# Altium project universky.PrjPcb
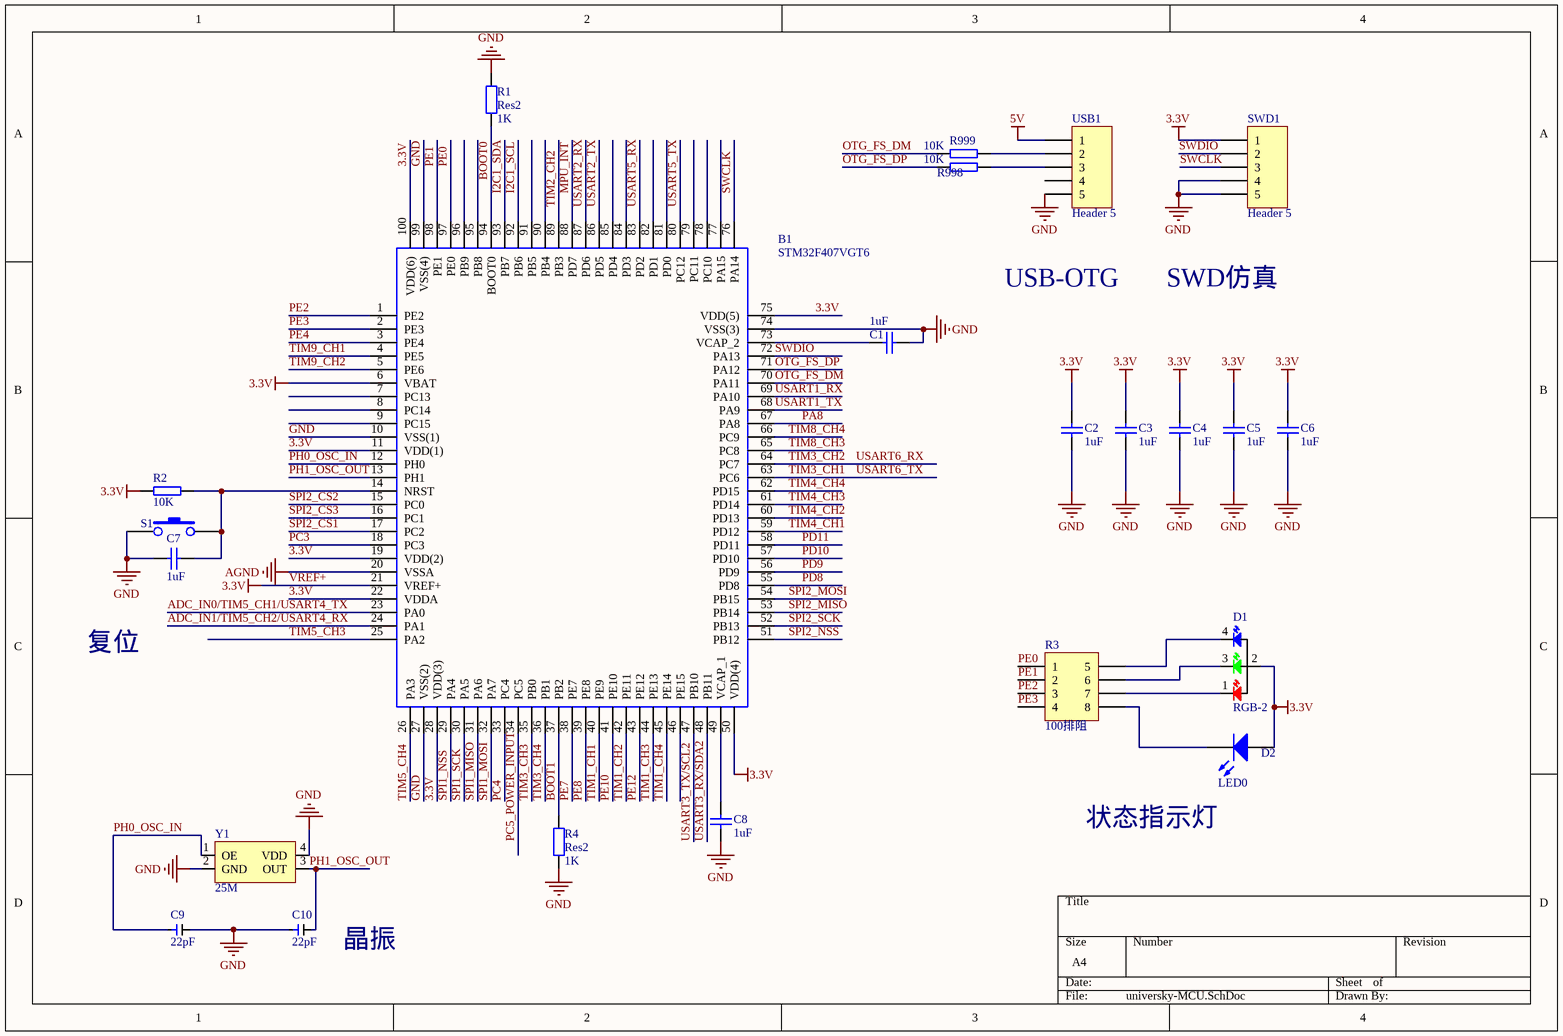
[diagram p0: universky-MCU.SchDoc]
4 sheets, 69 parts. Net scope: global (net labels, ports and power ports of the same name join across sheets).
Board file: universkyNew.PcbDoc
Sheets:
  universky-MCU.SchDoc
  universky-POWER.SchDoc
  universky-CONNECTOR.SchDoc
  universky-SENSOR.SchDoc

## Sheet universky-MCU.SchDoc
size A4

### Parts
B1  STM32F407VGT6  [QFP50P1600X1600X160-100N]
C1  value 1uF  [0603_C]  (hidden comment: Cap)
C2  value 1uF  [0603_C]  (hidden comment: Cap)
C3  value 1uF  [0603_C]  (hidden comment: Cap)
C4  value 1uF  [0603_C]  (hidden comment: Cap)
C5  value 1uF  [0603_C]  (hidden comment: Cap)
C6  value 1uF  [0603_C]  (hidden comment: Cap)
C7  value 1uF  [0603_C]  (hidden comment: Cap)
C8  value 1uF  [0603_C]  (hidden comment: Cap)
C9  22pF  [0603_C]
C10  22pF  [0603_C]
D1  RGB-2  [RGB-2]
D2  LED0  [0603_LED]
R1  Res2  value 1K  [0603_R]
R2  RES_10K  [0603_R]  (value not drawn)
R3  100排阻  [HDR_R_4]
R4  Res2  value 1K  [0603_R]
R998  RES_10K  [0603_R]  (value not drawn)
R999  RES_10K  [0603_R]  (value not drawn)
S1  SW-PB  [KEY_SMD]  (value not drawn)
SWD1  Header 5  [USB_M]
USB1  Header 5  [USB_M]
Y1  value 25M  [XTAL_3225]  (hidden comment: XATLS)

### Nets
3.3V: B1.6(VBAT) B1.11(VDD(1)) B1.19(VDD(2)) B1.21(VREF+) B1.22(VDDA) B1.28(VDD(3)) B1.50(VDD(4)) B1.75(VDD(5)) B1.100(VDD(6)) C2.2 C3.2 C4.2 C5.2 C6.2 D1.2 D2.1(A) R2.2 SWD1.1  [also labelled VREF+]
5V: USB1.1
AGND: B1.20(VSSA)
GND: B1.10(VSS(1)) B1.27(VSS(2)) B1.74(VSS(3)) B1.99(VSS(4)) C1.2 C2.1 C3.1 C4.1 C5.1 C6.1 C7.2 C8.1 C9.2 C10.1 R1.2 R4.1 S1.1 SWD1.4 SWD1.5 USB1.5 Y1.2(GND) Y1.4(VDD)
ADC_IN0/TIM5_CH1/USART4_TX: B1.23(PA0)
ADC_IN1/TIM5_CH2/USART4_RX: B1.24(PA1)
BOOT0: B1.94(BOOT0) R1.1
BOOT1: B1.37(PB2) R4.2
I2C1_SCL: B1.92(PB6)
I2C1_SDA: B1.93(PB7)
MPU_INT: B1.88(PD7)
OTG_FS_DM: B1.70(PA11) R999.2
OTG_FS_DP: B1.71(PA12) R998.2
PA8: B1.67(PA8)
PC3: B1.18(PC3)
PC4: B1.33(PC4)
PC5_POWER_INPUT: B1.34(PC5)
PD8: B1.55(PD8)
PD9: B1.56(PD9)
PD10: B1.57(PD10)
PD11: B1.58(PD11)
PE0: B1.97(PE0) R3.1
PE1: B1.98(PE1) R3.2
PE2: B1.1(PE2) R3.3
PE3: B1.2(PE3) R3.4
PE4: B1.3(PE4)
PE7: B1.38(PE7)
PE8: B1.39(PE8)
PE10: B1.41(PE10)
PE12: B1.43(PE12)
PH0_OSC_IN: B1.12(PH0) C9.1 Y1.1(OE)
PH1_OSC_OUT: B1.13(PH1) C10.2 Y1.3(OUT)
SPI1_MISO: B1.31(PA6)
SPI1_MOSI: B1.32(PA7)
SPI1_NSS: B1.29(PA4)
SPI1_SCK: B1.30(PA5)
SPI2_CS1: B1.17(PC2)
SPI2_CS2: B1.15(PC0)
SPI2_CS3: B1.16(PC1)
SPI2_MISO: B1.53(PB14)
SPI2_MOSI: B1.54(PB15)
SPI2_NSS: B1.51(PB12)
SPI2_SCK: B1.52(PB13)
SWCLK: B1.76(PA14) SWD1.3
SWDIO: B1.72(PA13) SWD1.2
TIM1_CH1: B1.40(PE9)
TIM1_CH2: B1.42(PE11)
TIM1_CH3: B1.44(PE13)
TIM1_CH4: B1.45(PE14)
TIM2_CH2: B1.89(PB3)
TIM3_CH1: B1.63(PC6)  [also labelled USART6_TX]
TIM3_CH2: B1.64(PC7)  [also labelled USART6_RX]
TIM3_CH3: B1.35(PB0)
TIM3_CH4: B1.36(PB1)
TIM4_CH1: B1.59(PD12)
TIM4_CH2: B1.60(PD13)
TIM4_CH3: B1.61(PD14)
TIM4_CH4: B1.62(PD15)
TIM5_CH3: B1.25(PA2)
TIM5_CH4: B1.26(PA3)
TIM8_CH3: B1.65(PC8)
TIM8_CH4: B1.66(PC9)
TIM9_CH1: B1.4(PE5)
TIM9_CH2: B1.5(PE6)
USART1_RX: B1.69(PA10)
USART1_TX: B1.68(PA9)
USART2_RX: B1.87(PD6)
USART2_TX: B1.86(PD5)
USART3_RX/SDA2: B1.48(PB11)
USART3_TX/SCL2: B1.47(PB10)
USART5_RX: B1.83(PD2)
USART5_TX: B1.80(PC12)
NetB1_14: B1.14(NRST) C7.1 R2.1 S1.2
NetB1_49: B1.49(VCAP_1) C8.2
NetB1_73: B1.73(VCAP_2) C1.1
NetD1_1: D1.1(R) R3.7
NetD1_3: D1.3(G) R3.6
NetD1_4: D1.4(B) R3.5
NetD2_2: D2.2(K) R3.8
NetR998_1: R998.1 USB1.3
NetR999_1: R999.1 USB1.2

Not connected (* = marked no-connect by the designer): B1 7(PC13) 8(PC14) 9(PC15) 46(PE15) 77(PA15) 78(PC10) 79(PC11) 81(PD0) 82(PD1) 84(PD3) 85(PD4) 90(PB4) 91(PB5) 95(PB8) 96(PB9); USB1 4

### Notes on the sheet
- USB-OTG
- SWD仿真
- 复位
- 状态指示灯
- (near C10) 晶振
- (in symbol RES_10K) 10K

### Library data of the parts
B1 = STM32F407VGT6: MCU 32-Bit, ARM Cortex M4, 1MB Flash STMicroelectronics STM32F407VGT6, 32bit ARM Cortex M4F Microcontroller, 168MHz, 1024 kB Flash, 100-Pin LQFP; Allied_Number: 70391107; Geometry.Height: 1.6mm; Supplier_Name: RS; RS Part Number: 7468226; Manufacturer_Name: STMicroelectronics; Manufacturer_Part_Number: STM32F407VGT6; Other Part Number: *; Datasheet Link: http://www.st.com/web/en/resource/technical/document/datasheet/DM00037051.pdf; 3D Package: *
C1-C8 = Cap: Capacitor; Published: 8-Jun-2000; LatestRevisionDate: 17-Jul-2002; LatestRevisionNote: Re-released for DXP Platform.; PackageReference: RAD-0.3; Publisher: Altium Limited; PackageDescription: Radial Cap, Thru-Hole; 2 Leads; 0.3 in Pin Spacing
C9 C10 = CAP
D2 = LED0: Typical INFRARED GaAs LED; Published: 8-Jun-2000; LatestRevisionDate: 08-Jul-2005; LatestRevisionNote: Mech Layer 1 removed.; PackageReference: LED-0; Publisher: Altium Limited; PackageDescription: LED; 2 Leads
R1 R4 = Res2: Resistor; Published: 8-Jun-2000; LatestRevisionDate: 17-Jul-2002; LatestRevisionNote: Re-released for DXP Platform.; PackageReference: AXIAL-0.4; Publisher: Altium Limited; PackageDescription: Axial Device, Thru-Hole; 2 Leads; 0.4 in Pin Spacing
R3 = Header 4X2A: Header, 4-Pin, Dual row; LatestRevisionDate: 17-Jul-2002; LatestRevisionNote: Re-released for DXP Platform.; Publisher: Altium Limited
SWD1 USB1 = Header 5: Header, 5-Pin; LatestRevisionDate: 17-Jul-2002; LatestRevisionNote: Re-released for DXP Platform.; Publisher: Altium Limited
Y1 = XATLS: 贴片有源晶振

## Sheet universky-POWER.SchDoc
size A4
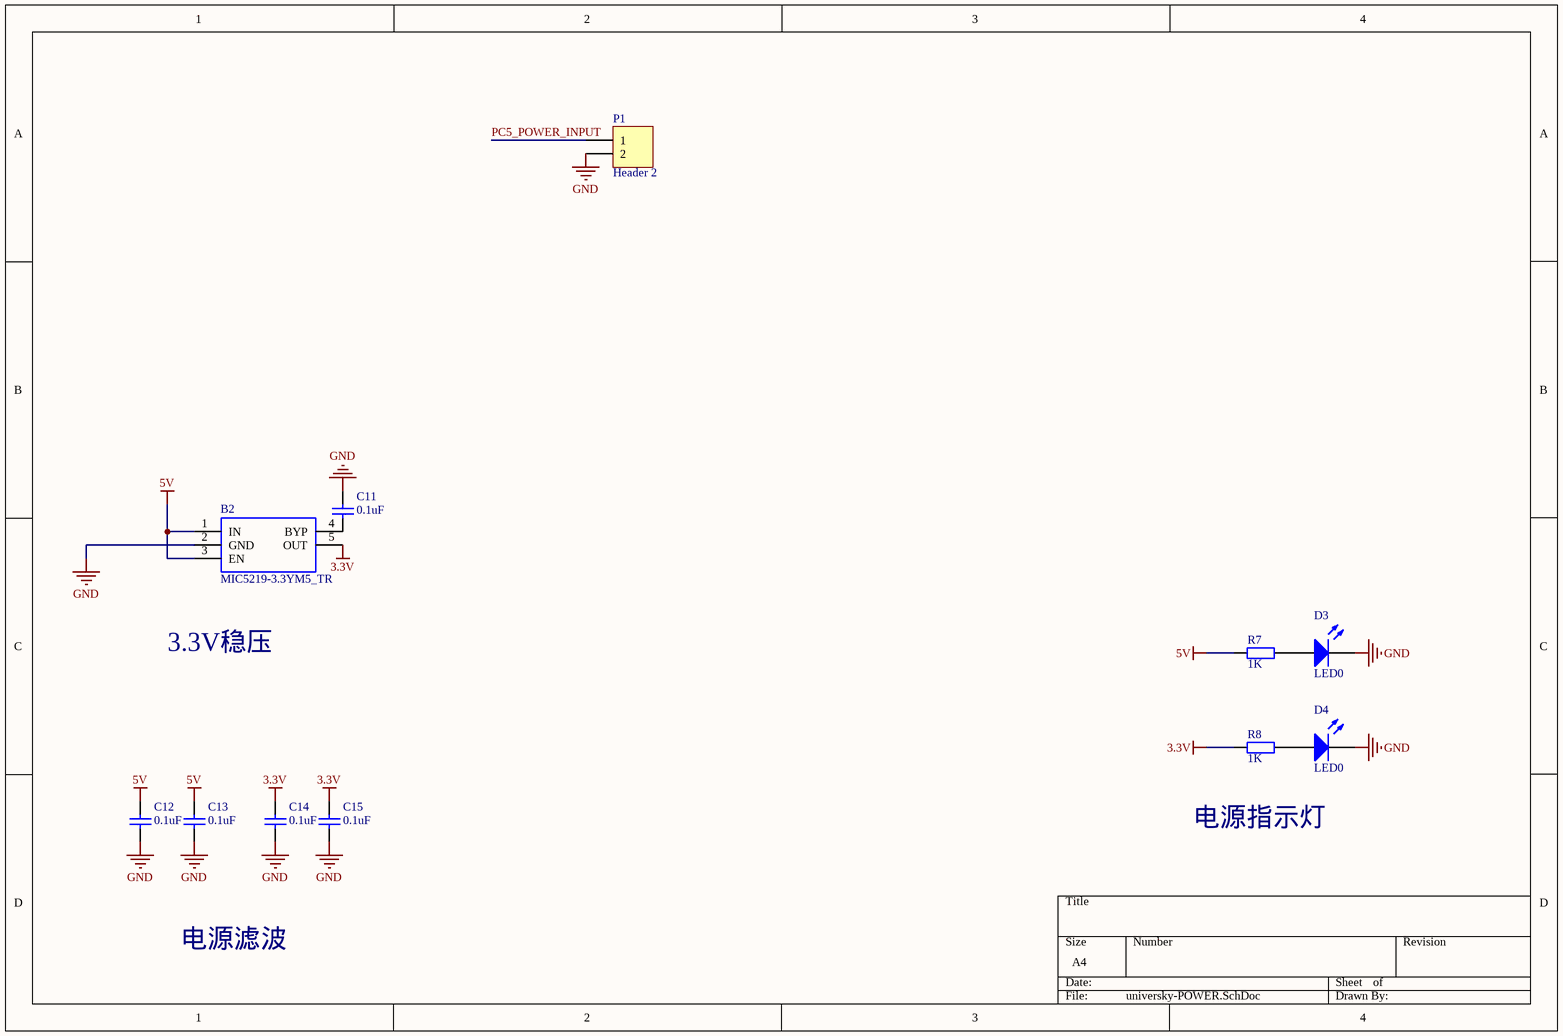
[diagram p1: universky-POWER.SchDoc]

### Parts
B2  MIC5219-3.3YM5_TR  [SOT95P280X145-5N]
C11  value 0.1uF  [0603_C]  (hidden comment: Cap)
C12  value 0.1uF  [0603_C]  (hidden comment: Cap)
C13  value 0.1uF  [0603_C]  (hidden comment: Cap)
C14  value 0.1uF  [0603_C]  (hidden comment: Cap)
C15  value 0.1uF  [0603_C]  (hidden comment: Cap)
D3  LED0  [0603_LED]
D4  LED0  [0603_LED]
P1  Header 2  [HDR1X2]
R7  value 1K  [0603_R]  (hidden comment: Res2)
R8  value 1K  [0603_R]  (hidden comment: Res2)

### Nets
3.3V: B2.5(OUT) C14.2 C15.2 R8.1
5V: B2.1(IN) B2.3(EN) C12.2 C13.2 R7.1
GND: B2.2(GND) C11.2 C12.1 C13.1 C14.1 C15.1 D3.2(K) D4.2(K) P1.2
PC5_POWER_INPUT: P1.1
NetB2_4: B2.4(BYP) C11.1
NetD3_1: D3.1(A) R7.2
NetD4_1: D4.1(A) R8.2

### Notes on the sheet
- 3.3V稳压
- 电源指示灯
- 电源滤波

### Library data of the parts
B2 = MIC5219-3.3YM5_TR: LDO Regulator Pos 3.3V 0.5A MIC5219-3.3YM5 TR, Low Dropout Voltage Regulator, 0.5A, 3.3 V ??1%, 2.5 ??? 12 Vin, 5-Pin SOT-23; Manufacturer_Name: Micrel; Allied_Number: R1033592; Geometry.Height: 1.45mm; Supplier_Name: RS; RS Part Number: 7272524; Manufacturer_Part_Number: MIC5219-3.3YM5 TR; Other Part Number: *; Datasheet Link: http://docs-europe.electrocomponents.com/webdocs/1385/0900766b8138542f.pdf; 3D Package: *
C11-C15 = Cap: Capacitor; Published: 8-Jun-2000; LatestRevisionDate: 17-Jul-2002; LatestRevisionNote: Re-released for DXP Platform.; PackageReference: RAD-0.3; Publisher: Altium Limited; PackageDescription: Radial Cap, Thru-Hole; 2 Leads; 0.3 in Pin Spacing
D3 D4 = LED0: Typical INFRARED GaAs LED; Published: 8-Jun-2000; LatestRevisionDate: 08-Jul-2005; LatestRevisionNote: Mech Layer 1 removed.; PackageReference: LED-0; Publisher: Altium Limited; PackageDescription: LED; 2 Leads
P1 = Header 2: Header, 2-Pin; LatestRevisionDate: 17-Jul-2002; LatestRevisionNote: Re-released for DXP Platform.; Publisher: Altium Limited
R7 R8 = Res2: Resistor; Published: 8-Jun-2000; LatestRevisionDate: 17-Jul-2002; LatestRevisionNote: Re-released for DXP Platform.; PackageReference: AXIAL-0.4; Publisher: Altium Limited; PackageDescription: Axial Device, Thru-Hole; 2 Leads; 0.4 in Pin Spacing

## Sheet universky-CONNECTOR.SchDoc
size A4
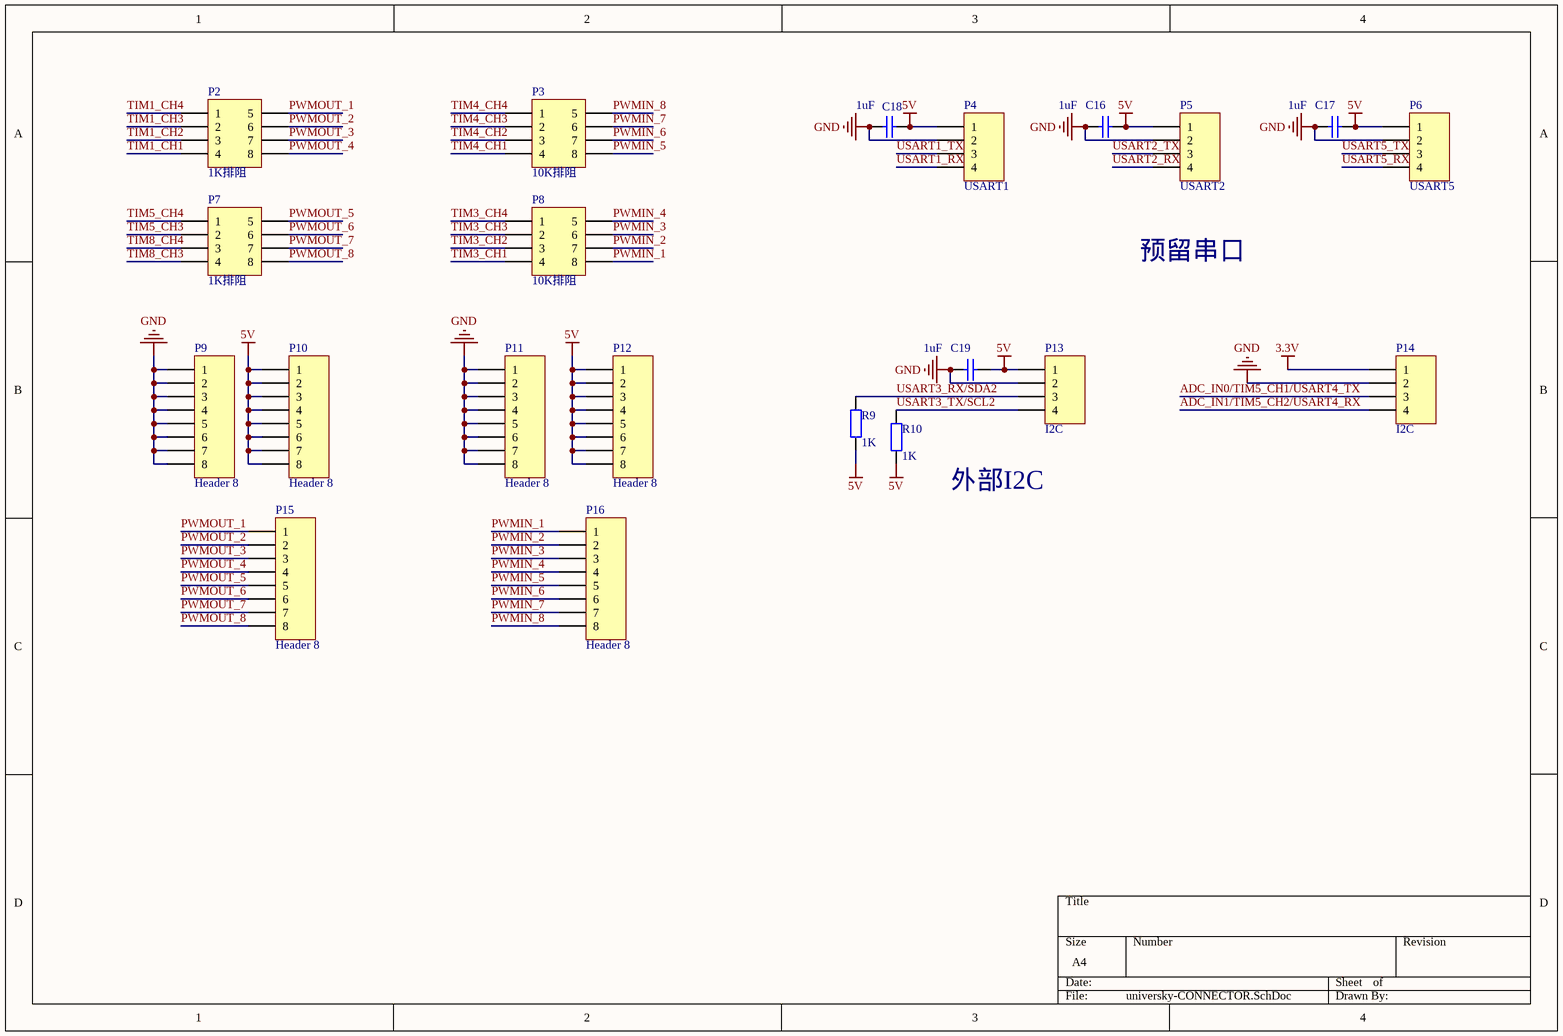
[diagram p2: universky-CONNECTOR.SchDoc]

### Parts
C16  value 1uF  [0603_C]  (hidden comment: Cap)
C17  value 1uF  [0603_C]  (hidden comment: Cap)
C18  value 1uF  [0603_C]  (hidden comment: Cap)
C19  value 1uF  [0603_C]  (hidden comment: Cap)
P2  1K排阻  [HDR_R_4]
P3  10K排阻  [HDR_R_4]
P4  USART1  [SMD-1.25]
P5  USART2  [SMD-1.25]
P6  USART5  [SMD-1.25]
P7  1K排阻  [HDR_R_4]
P8  10K排阻  [HDR_R_4]
P9  Header 8  [HDR1X8]
P10  Header 8  [HDR1X8]
P11  Header 8  [HDR1X8]
P12  Header 8  [HDR1X8]
P13  I2C  [SMD-1.25]
P14  I2C  [SMD-1.25]
P15  Header 8  [HDR1X8]
P16  Header 8  [HDR1X8]
R9  value 1K  [0603_R]  (hidden comment: Res2)
R10  value 1K  [0603_R]  (hidden comment: Res2)

### Nets
3.3V: P14.1
5V: C16.1 C17.1 C18.1 C19.1 P4.1 P5.1 P6.1 P10.1 P10.2 P10.3 P10.4 P10.5 P10.6 P10.7 P10.8 P12.1 P12.2 P12.3 P12.4 P12.5 P12.6 P12.7 P12.8 P13.1 R9.1 R10.1
GND: C16.2 C17.2 C18.2 C19.2 P4.2 P5.2 P6.2 P9.1 P9.2 P9.3 P9.4 P9.5 P9.6 P9.7 P9.8 P11.1 P11.2 P11.3 P11.4 P11.5 P11.6 P11.7 P11.8 P13.2 P14.2
ADC_IN0/TIM5_CH1/USART4_TX: P14.3
ADC_IN1/TIM5_CH2/USART4_RX: P14.4
PWMIN_1: P8.8 P16.1
PWMIN_2: P8.7 P16.2
PWMIN_3: P8.6 P16.3
PWMIN_4: P8.5 P16.4
PWMIN_5: P3.8 P16.5
PWMIN_6: P3.7 P16.6
PWMIN_7: P3.6 P16.7
PWMIN_8: P3.5 P16.8
PWMOUT_1: P2.5 P15.1
PWMOUT_2: P2.6 P15.2
PWMOUT_3: P2.7 P15.3
PWMOUT_4: P2.8 P15.4
PWMOUT_5: P7.5 P15.5
PWMOUT_6: P7.6 P15.6
PWMOUT_7: P7.7 P15.7
PWMOUT_8: P7.8 P15.8
TIM1_CH1: P2.4
TIM1_CH2: P2.3
TIM1_CH3: P2.2
TIM1_CH4: P2.1
TIM3_CH1: P8.4
TIM3_CH2: P8.3
TIM3_CH3: P8.2
TIM3_CH4: P8.1
TIM4_CH1: P3.4
TIM4_CH2: P3.3
TIM4_CH3: P3.2
TIM4_CH4: P3.1
TIM5_CH3: P7.2
TIM5_CH4: P7.1
TIM8_CH3: P7.4
TIM8_CH4: P7.3
USART1_RX: P4.4
USART1_TX: P4.3
USART2_RX: P5.4
USART2_TX: P5.3
USART3_RX/SDA2: P13.3 R9.2
USART3_TX/SCL2: P13.4 R10.2
USART5_RX: P6.4
USART5_TX: P6.3

### Notes on the sheet
- 预留串口
- 外部I2C

### Library data of the parts
C16-C19 = Cap: Capacitor; Published: 8-Jun-2000; LatestRevisionDate: 17-Jul-2002; LatestRevisionNote: Re-released for DXP Platform.; PackageReference: RAD-0.3; Publisher: Altium Limited; PackageDescription: Radial Cap, Thru-Hole; 2 Leads; 0.3 in Pin Spacing
P2 P3 P7 P8 = Header 4X2A: Header, 4-Pin, Dual row; LatestRevisionDate: 17-Jul-2002; LatestRevisionNote: Re-released for DXP Platform.; Publisher: Altium Limited
P4-P6 P13 P14 = Header 4: Header, 4-Pin; LatestRevisionDate: 17-Jul-2002; LatestRevisionNote: Re-released for DXP Platform.; Publisher: Altium Limited
P9-P12 P15 P16 = Header 8: Header, 8-Pin; LatestRevisionDate: 17-Jul-2002; LatestRevisionNote: Re-released for DXP Platform.; Publisher: Altium Limited
R9 R10 = Res2: Resistor; Published: 8-Jun-2000; LatestRevisionDate: 17-Jul-2002; LatestRevisionNote: Re-released for DXP Platform.; PackageReference: AXIAL-0.4; Publisher: Altium Limited; PackageDescription: Axial Device, Thru-Hole; 2 Leads; 0.4 in Pin Spacing

## Sheet universky-SENSOR.SchDoc
size A4
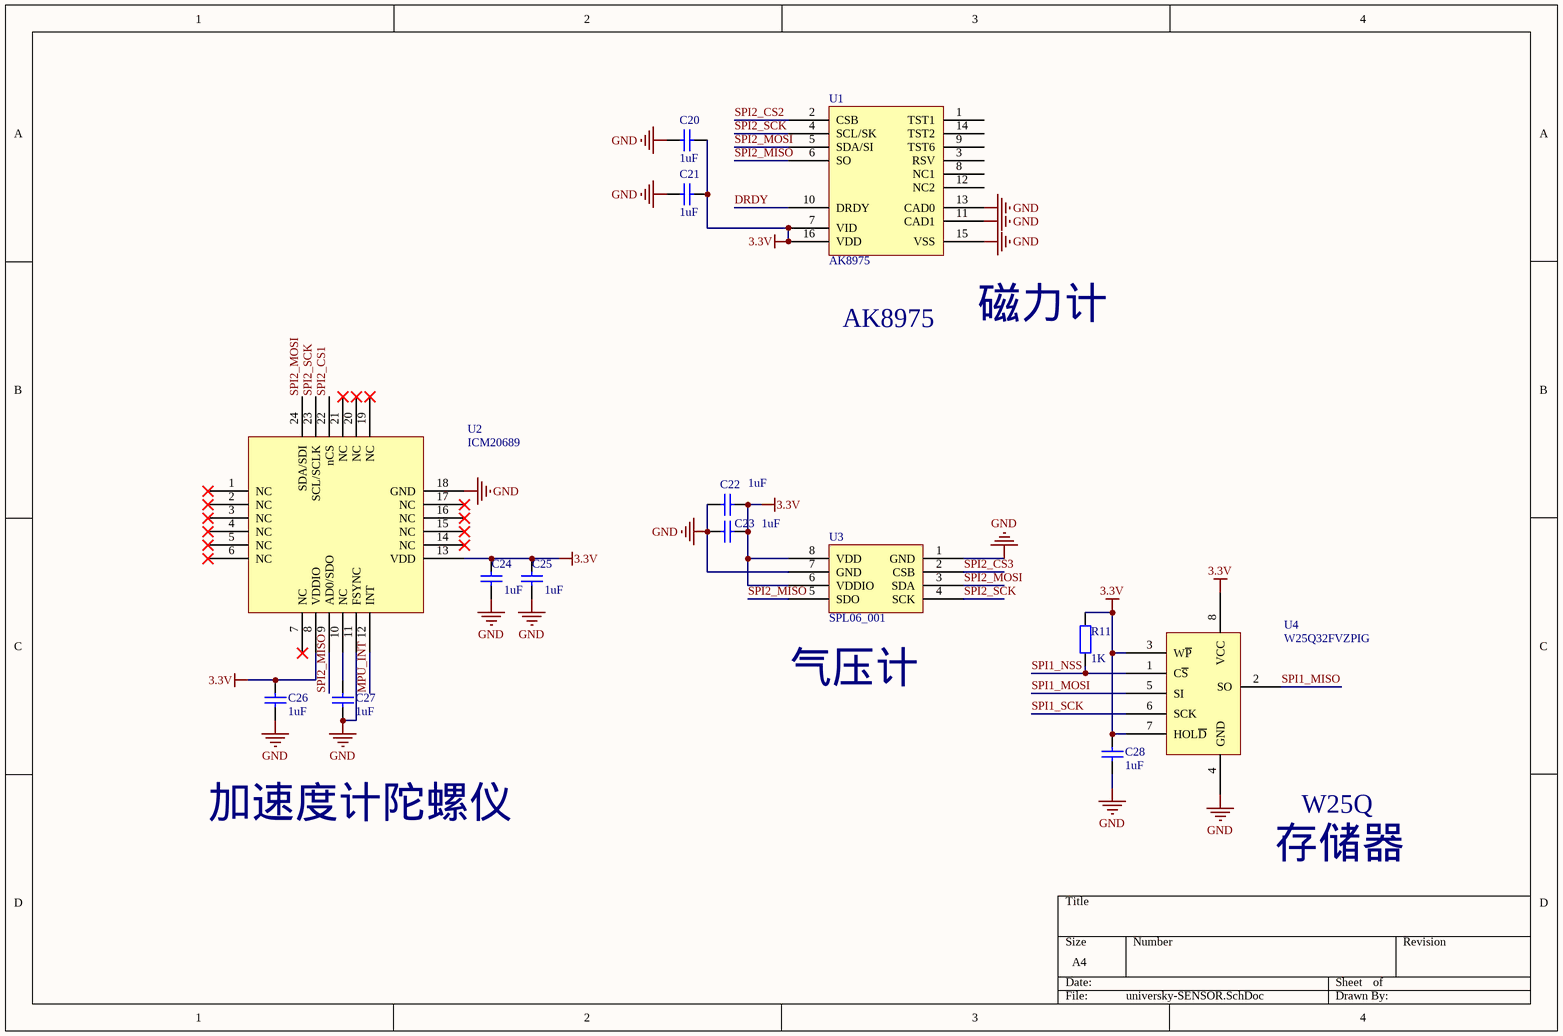
[diagram p3: universky-SENSOR.SchDoc]

### Parts
C20  value 1uF  [0603_C]  (hidden comment: Cap)
C21  value 1uF  [0603_C]  (hidden comment: Cap)
C22  value 1uF  [0603_C]  (hidden comment: Cap)
C23  value 1uF  [0603_C]  (hidden comment: Cap)
C24  value 1uF  [0603_C]  (hidden comment: Cap)
C25  value 1uF  [0603_C]  (hidden comment: Cap)
C26  value 1uF  [0603_C]  (hidden comment: Cap)
C27  value 1uF  [0603_C]  (hidden comment: Cap)
C28  value 1uF  [0603_C]  (hidden comment: Cap)
R11  value 1K  [0603_R]  (hidden comment: Res2)
U1  AK8975  [QFN_16]
U2  ICM20689  [QFN_24]
U3  SPL06_001
U4  W25Q32FVZPIG  [WDFN_8]

### Nets
3.3V: C20.1 C21.1 C22.1 C23.1 C24.2 C25.2 C26.2 C28.1 R11.2 U1.7(VID) U1.16(VDD) U2.8(VDDIO) U2.13(VDD) U3.6(VDDIO) U3.8(VDD) U4.3(W~{P}) U4.7(HOL~{D}) U4.8(VCC)
GND: C20.2 C21.2 C22.2 C23.2 C24.1 C25.1 C26.1 C27.1 C28.2 U1.11(CAD1) U1.13(CAD0) U1.15(VSS) U2.11(FSYNC) U2.18(GND) U3.1(GND) U3.7(GND) U4.4(GND)
DRDY: U1.10(DRDY)
MPU_INT: U2.12(INT)
SPI1_MISO: U4.2(SO)
SPI1_MOSI: U4.5(SI)
SPI1_NSS: R11.1 U4.1(C~{S})
SPI1_SCK: U4.6(SCK)
SPI2_CS1: U2.22(nCS)
SPI2_CS2: U1.2(CSB)
SPI2_CS3: U3.2(CSB)
SPI2_MISO: U1.6(SO) U2.9(AD0/SDO) U3.5(SDO)
SPI2_MOSI: U1.5(SDA/SI) U2.24(SDA/SDI) U3.3(SDA)
SPI2_SCK: U1.4(SCL/SK) U2.23(SCL/SCLK) U3.4(SCK)
NetC27_2: C27.2 U2.10(NC)

Not connected (* = marked no-connect by the designer): U1 1(TST1) 3(RSV) 8(NC1) 9(TST6) 12(NC2) 14(TST2); U2 1(NC)* 2(NC)* 3(NC)* 4(NC)* 5(NC)* 6(NC)* 7(NC)* 14(NC)* 15(NC)* 16(NC)* 17(NC)* 19(NC)* 20(NC)* 21(NC)*

### Notes on the sheet
- AK8975
- (near U1) 磁力计
- (near U3) 气压计
- W25Q
- 加速度计陀螺仪
- 存储器

### Library data of the parts
C20-C28 = Cap: Capacitor; Published: 8-Jun-2000; LatestRevisionDate: 17-Jul-2002; LatestRevisionNote: Re-released for DXP Platform.; PackageReference: RAD-0.3; Publisher: Altium Limited; PackageDescription: Radial Cap, Thru-Hole; 2 Leads; 0.3 in Pin Spacing
R11 = Res2: Resistor; Published: 8-Jun-2000; LatestRevisionDate: 17-Jul-2002; LatestRevisionNote: Re-released for DXP Platform.; PackageReference: AXIAL-0.4; Publisher: Altium Limited; PackageDescription: Axial Device, Thru-Hole; 2 Leads; 0.4 in Pin Spacing

## Nets that join several sheets
3.3V: universky-MCU (18 pins), universky-POWER (B2.5 C14.2 C15.2 R8.1), universky-CONNECTOR (P14.1), universky-SENSOR (18 pins)
5V: universky-MCU (USB1.1), universky-POWER (5 pins), universky-CONNECTOR (26 pins)
GND: universky-MCU (22 pins), universky-POWER (9 pins), universky-CONNECTOR (25 pins), universky-SENSOR (17 pins)
ADC_IN0/TIM5_CH1/USART4_TX: universky-MCU (B1.23), universky-CONNECTOR (P14.3)
ADC_IN1/TIM5_CH2/USART4_RX: universky-MCU (B1.24), universky-CONNECTOR (P14.4)
MPU_INT: universky-MCU (B1.88), universky-SENSOR (U2.12)
PC5_POWER_INPUT: universky-MCU (B1.34), universky-POWER (P1.1)
SPI1_MISO: universky-MCU (B1.31), universky-SENSOR (U4.2)
SPI1_MOSI: universky-MCU (B1.32), universky-SENSOR (U4.5)
SPI1_NSS: universky-MCU (B1.29), universky-SENSOR (R11.1 U4.1)
SPI1_SCK: universky-MCU (B1.30), universky-SENSOR (U4.6)
SPI2_CS1: universky-MCU (B1.17), universky-SENSOR (U2.22)
SPI2_CS2: universky-MCU (B1.15), universky-SENSOR (U1.2)
SPI2_CS3: universky-MCU (B1.16), universky-SENSOR (U3.2)
SPI2_MISO: universky-MCU (B1.53), universky-SENSOR (U1.6 U2.9 U3.5)
SPI2_MOSI: universky-MCU (B1.54), universky-SENSOR (U1.5 U2.24 U3.3)
SPI2_SCK: universky-MCU (B1.52), universky-SENSOR (U1.4 U2.23 U3.4)
TIM1_CH1: universky-MCU (B1.40), universky-CONNECTOR (P2.4)
TIM1_CH2: universky-MCU (B1.42), universky-CONNECTOR (P2.3)
TIM1_CH3: universky-MCU (B1.44), universky-CONNECTOR (P2.2)
TIM1_CH4: universky-MCU (B1.45), universky-CONNECTOR (P2.1)
TIM3_CH1: universky-MCU (B1.63), universky-CONNECTOR (P8.4)
TIM3_CH2: universky-MCU (B1.64), universky-CONNECTOR (P8.3)
TIM3_CH3: universky-MCU (B1.35), universky-CONNECTOR (P8.2)
TIM3_CH4: universky-MCU (B1.36), universky-CONNECTOR (P8.1)
TIM4_CH1: universky-MCU (B1.59), universky-CONNECTOR (P3.4)
TIM4_CH2: universky-MCU (B1.60), universky-CONNECTOR (P3.3)
TIM4_CH3: universky-MCU (B1.61), universky-CONNECTOR (P3.2)
TIM4_CH4: universky-MCU (B1.62), universky-CONNECTOR (P3.1)
TIM5_CH3: universky-MCU (B1.25), universky-CONNECTOR (P7.2)
TIM5_CH4: universky-MCU (B1.26), universky-CONNECTOR (P7.1)
TIM8_CH3: universky-MCU (B1.65), universky-CONNECTOR (P7.4)
TIM8_CH4: universky-MCU (B1.66), universky-CONNECTOR (P7.3)
USART1_RX: universky-MCU (B1.69), universky-CONNECTOR (P4.4)
USART1_TX: universky-MCU (B1.68), universky-CONNECTOR (P4.3)
USART2_RX: universky-MCU (B1.87), universky-CONNECTOR (P5.4)
USART2_TX: universky-MCU (B1.86), universky-CONNECTOR (P5.3)
USART3_RX/SDA2: universky-MCU (B1.48), universky-CONNECTOR (P13.3 R9.2)
USART3_TX/SCL2: universky-MCU (B1.47), universky-CONNECTOR (P13.4 R10.2)
USART5_RX: universky-MCU (B1.83), universky-CONNECTOR (P6.4)
USART5_TX: universky-MCU (B1.80), universky-CONNECTOR (P6.3)